# EAGLE design PCB-JOY-4AXIS_adaptorHirose (EAGLE 7.7.0)
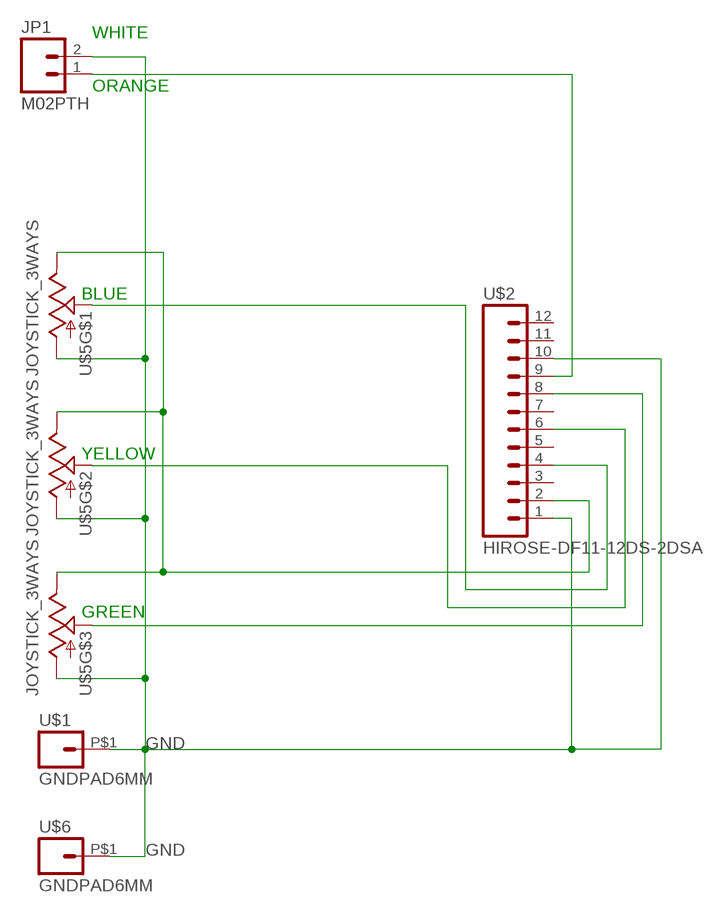
[diagram p0: schematic, sheet 1]

## Parts
JP1  M02PTH  [1X02]
U$1  GNDPAD6MM  [3.2MMPAD6MM]
U$2  HIROSE-DF11-12DS-2DSA  [2X6HIROSE_DF11-12DS-2DSA]
U$5  JOYSTICK_3WAYS  [JOYSTICK]
U$6  GNDPAD6MM  [3.2MMPAD6MM]

## Nets
GND [Power]: JP1.2 U$1.P$1 U$2.1 U$2.10 U$5.LR_COM(A) U$5.ROT_COM(A) U$5.UD_COM(A) U$6.P$1
N$1: U$2.2 U$5.LR_V(E) U$5.ROT_V(E) U$5.UD_V(E)
N$2: U$2.4 U$5.LR_C(S)
N$3: U$2.6 U$5.UD_C(S)
N$4: U$2.8 U$5.ROT_C(S)
N$5: JP1.1 U$2.9
Unconnected: U$2.3 U$2.5 U$2.7 U$2.11 U$2.12

## Notes on the sheet
- WHITE
- ORANGE
- BLUE
- YELLOW
- GREEN

## Library data of the parts
JP1 = SparkFun-Connectors:M02: Standard 2-pin 0.1" header. Use with - straight break away headers ( PRT-00116) - right angle break away headers (PRT-00553) - swiss pins (PRT-00743) - machine pins (PRT-00117) - female headers (PRT-00115) Molex polarized connector foot print use with: PRT-08233 with associated crimp pins and housings. 2.54_SCREWTERM for use with PRT-10571. 3.5mm Screw Terminal footprints for PRT-08084 5mm Screw Terminal footprints for use with PRT-08433
U$1 U$6 = SKAARHOJ:GNDPAD
U$2 = SKAARHOJ:HIROSE-DF11-12DS-2DSA
U$5 = SKAARHOJ:JOYSTICK_3WAYS

## Net classes
0 default: width 0.203 mm, drill 0.406 mm, clearance 0.203 mm
1 Power: width 0.305 mm, drill 0.61 mm, clearance 0.203 mm

## Board
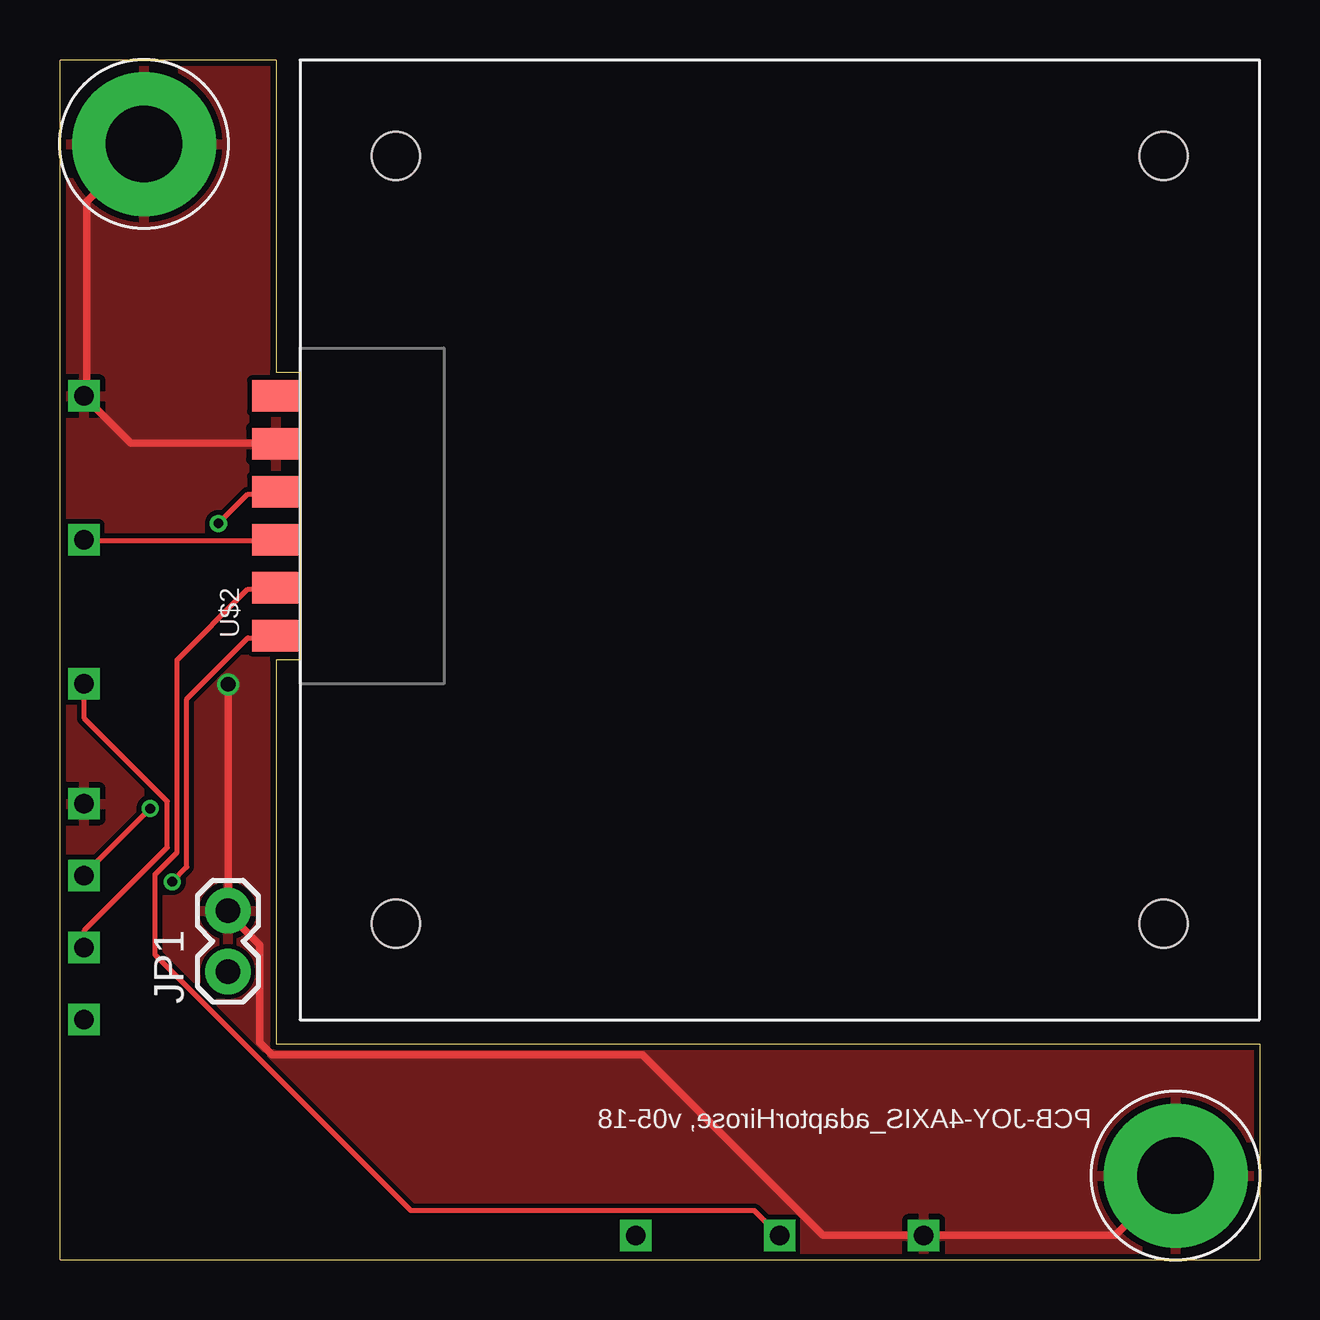
[diagram p1: board, top side]
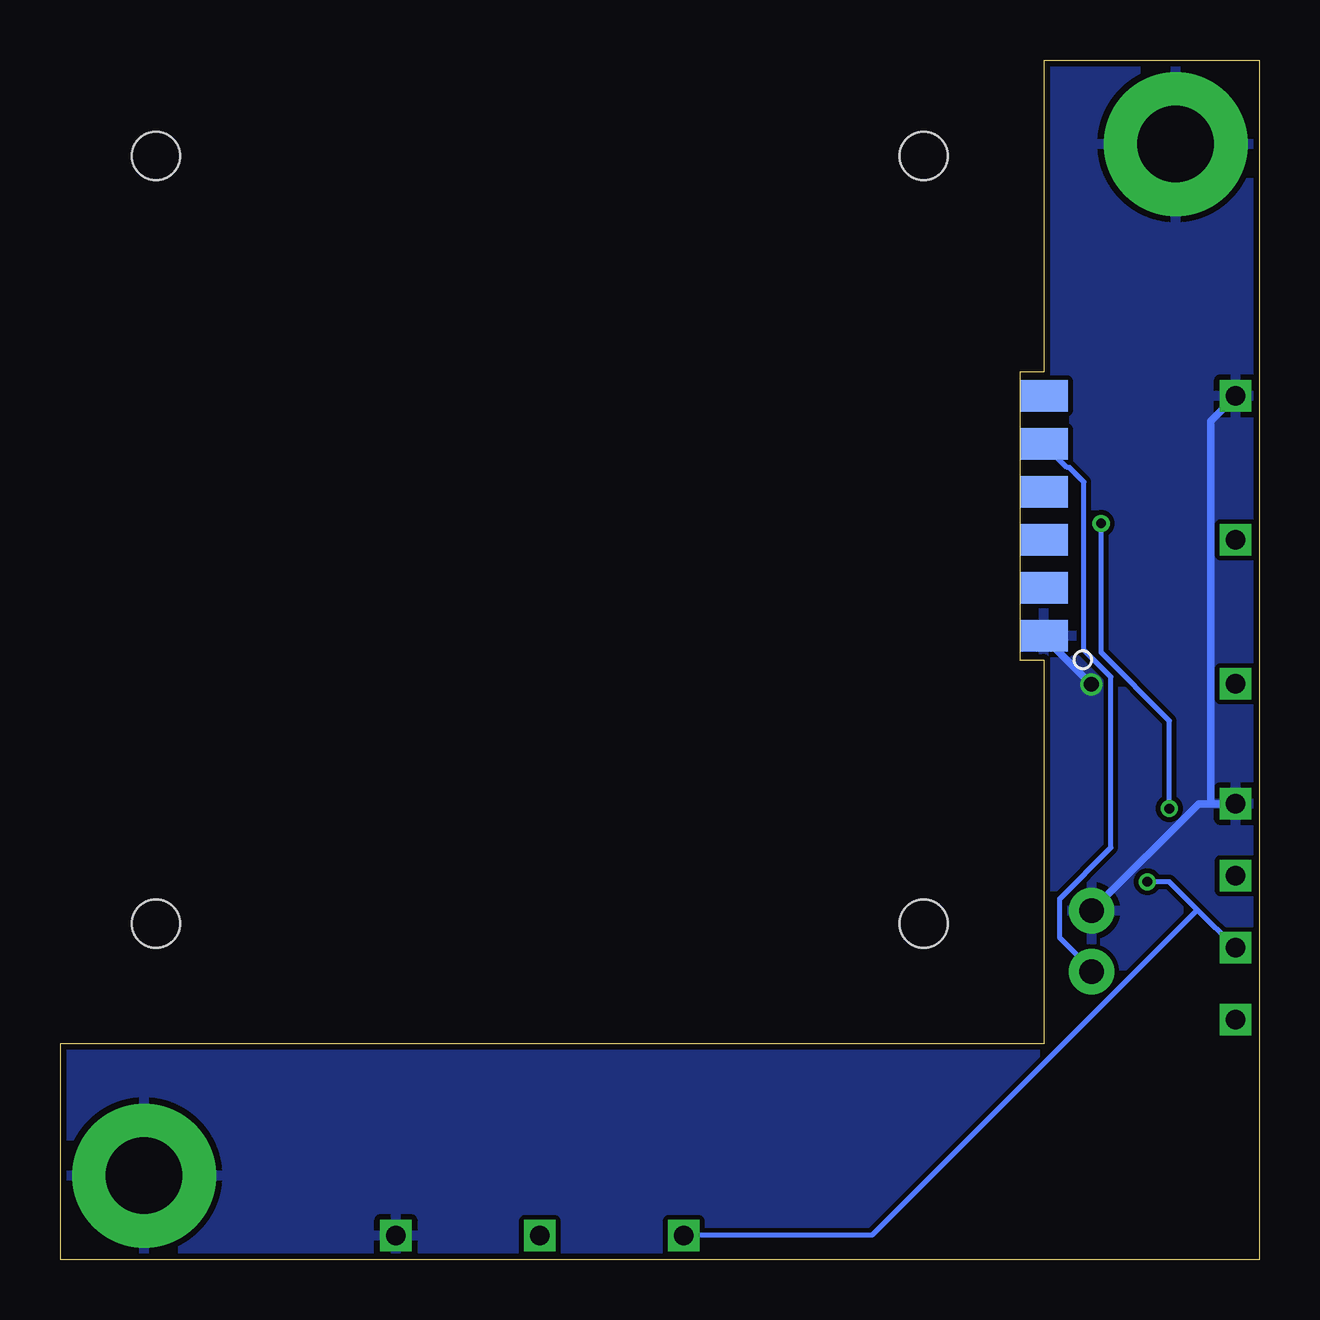
[diagram p2: board, bottom side, seen from below]

Size 50 x 50 mm. Coordinates in mm from the lower left corner, seen from the top.
Outline: 0,0 50,0 50,9 9,9 9,25 10,25 10,37 9,37 9,50 0,50 0,0
Copper layers (1*16): Top 0.035mm / dielectric 1.5mm / Bottom 0.035mm
Design rules "Fusion_eagle_rule_v1.1": minimum track width 6mil, minimum drill 12mil, track to track 6mil, track to pad 6mil, pad to pad 6mil, via to via 6mil, smd to smd 0mil, copper to edge 10mil, drill to drill 10mil, minimum pad ring 10mil, minimum via ring 6mil, stop-mask expansion 2mil, vias tented up to drill 100mil, thermal gap 10mil

### Footprints (pad centres in the part's own frame; a part is rotated, then mirrored left to right if it is on the bottom)
1X02 = drill 1.016 pad 1.88: 1 0,0; 2 2.54,0
3.2MMPAD6MM = drill 3.2 pad 6: P$1 0,0
2X6HIROSE_DF11-12DS-2DSA = smd 2 x 1.3 bottom: 1 -1,-5; 3 -1,-3; 5 -1,-1; 7 -1,1; 9 -1,3; 11 -1,5 | smd 2 x 1.3: 2 -1,-5; 4 -1,-3; 6 -1,-1; 8 -1,1; 10 -1,3; 12 -1,5
JOYSTICK = drill 0.8 square: LR_C 0,29; LR_COM -6,29; LR_V 6,29; PUSH 29,20; ROT_C 29,14; ROT_COM 29,11; ROT_V 29,17; UD_C 29,0; UD_COM 29,-6; UD_V 29,6 | hole 2: -16,16; 16,16; 16,-16; -16,-16

### Placement (x,y rotation side)
JP1  7,12 90 top
U$1  3.5,46.5 0 top
U$2  10,31 0 top
U$5  30,30 180 top
U$6  46.5,3.5 0 top

### Tracks (layer width: path | path; a pad name or v marks a point on that pad's centre or on a via)
GND  (via drill 0.61)
  Top 0.305: U$6.P$1 46.43,3.45 43.99,1.02 36.07,1.02 U$5.LR_COM 35.87,1.02 31.8,1.02 24.28,8.53 8.84,8.53 8.33,9.04 8.33,13.11 7.01,14.43 JP1.2 7.01,14.63 v7.01,23.98 | U$2.10 8.94,34.04 2.95,34.04 1.02,35.97 U$5.UD_COM 1.12,36.07 1.12,44.09 3.45,46.43 U$1.P$1
  Bottom 0.305: v7.01,23.98 8.94,25.91 U$2.1 | 2.03,19 2.54,19 6.91,14.63 JP1.2 | 2.03,19 1.02,19 U$5.ROT_COM | 2.03,19 2.03,34.95 1.02,35.97 U$5.UD_COM
  pour Bottom: 0,0 50,0 50,50 0,50
  pour Top: 0,0 50,0 50,50 0,50
N$1  (via drill 0.41)
  Top 0.203: v4.67,15.75 5.28,16.36 5.28,23.37 7.82,25.91 8.94,25.91 U$2.2 | U$5.UD_V 1.02,23.98 1.02,22.55 4.47,19.1 4.47,17.17 1.02,13.72 1.02,13.01 U$5.ROT_V
  Bottom 0.203: v4.67,15.75 3.76,15.75 2.59,14.58 | 2.59,14.58 1.02,13.01 U$5.ROT_V | 2.59,14.58 16.15,1.02 23.98,1.02 U$5.LR_V
N$2
  Top 0.203: U$2.4 8.94,27.94 7.82,27.94 4.88,24.99 4.88,16.97 3.96,16.05 3.96,12.7 14.63,2.03 28.96,2.03 29.97,1.02 U$5.LR_C
N$3
  Top 0.203: U$2.6 8.94,29.97 1.02,29.97 U$5.UD_C
N$4  (via drill 0.41)
  Top 0.203: v6.6,30.68 7.82,31.9 8.94,31.9 U$2.8 | v3.76,18.8 1.02,16.05 U$5.ROT_C
  Bottom 0.203: v6.6,30.68 6.6,25.3 3.76,22.45 v3.76,18.8
N$5
  Bottom 0.203: U$2.9 8.94,33.93 8.03,33.02 7.92,33.02 7.32,32.41 7.32,25.4 6.2,24.28 6.2,17.17 8.33,15.04 8.33,13.41 7.01,12.09 JP1.1

### Text on the board
_tsilk: PCB-JOY-4AXIS_adaptorHirose, v05-18